# EAGLE design H3AR1 (EAGLE 9.6.1)
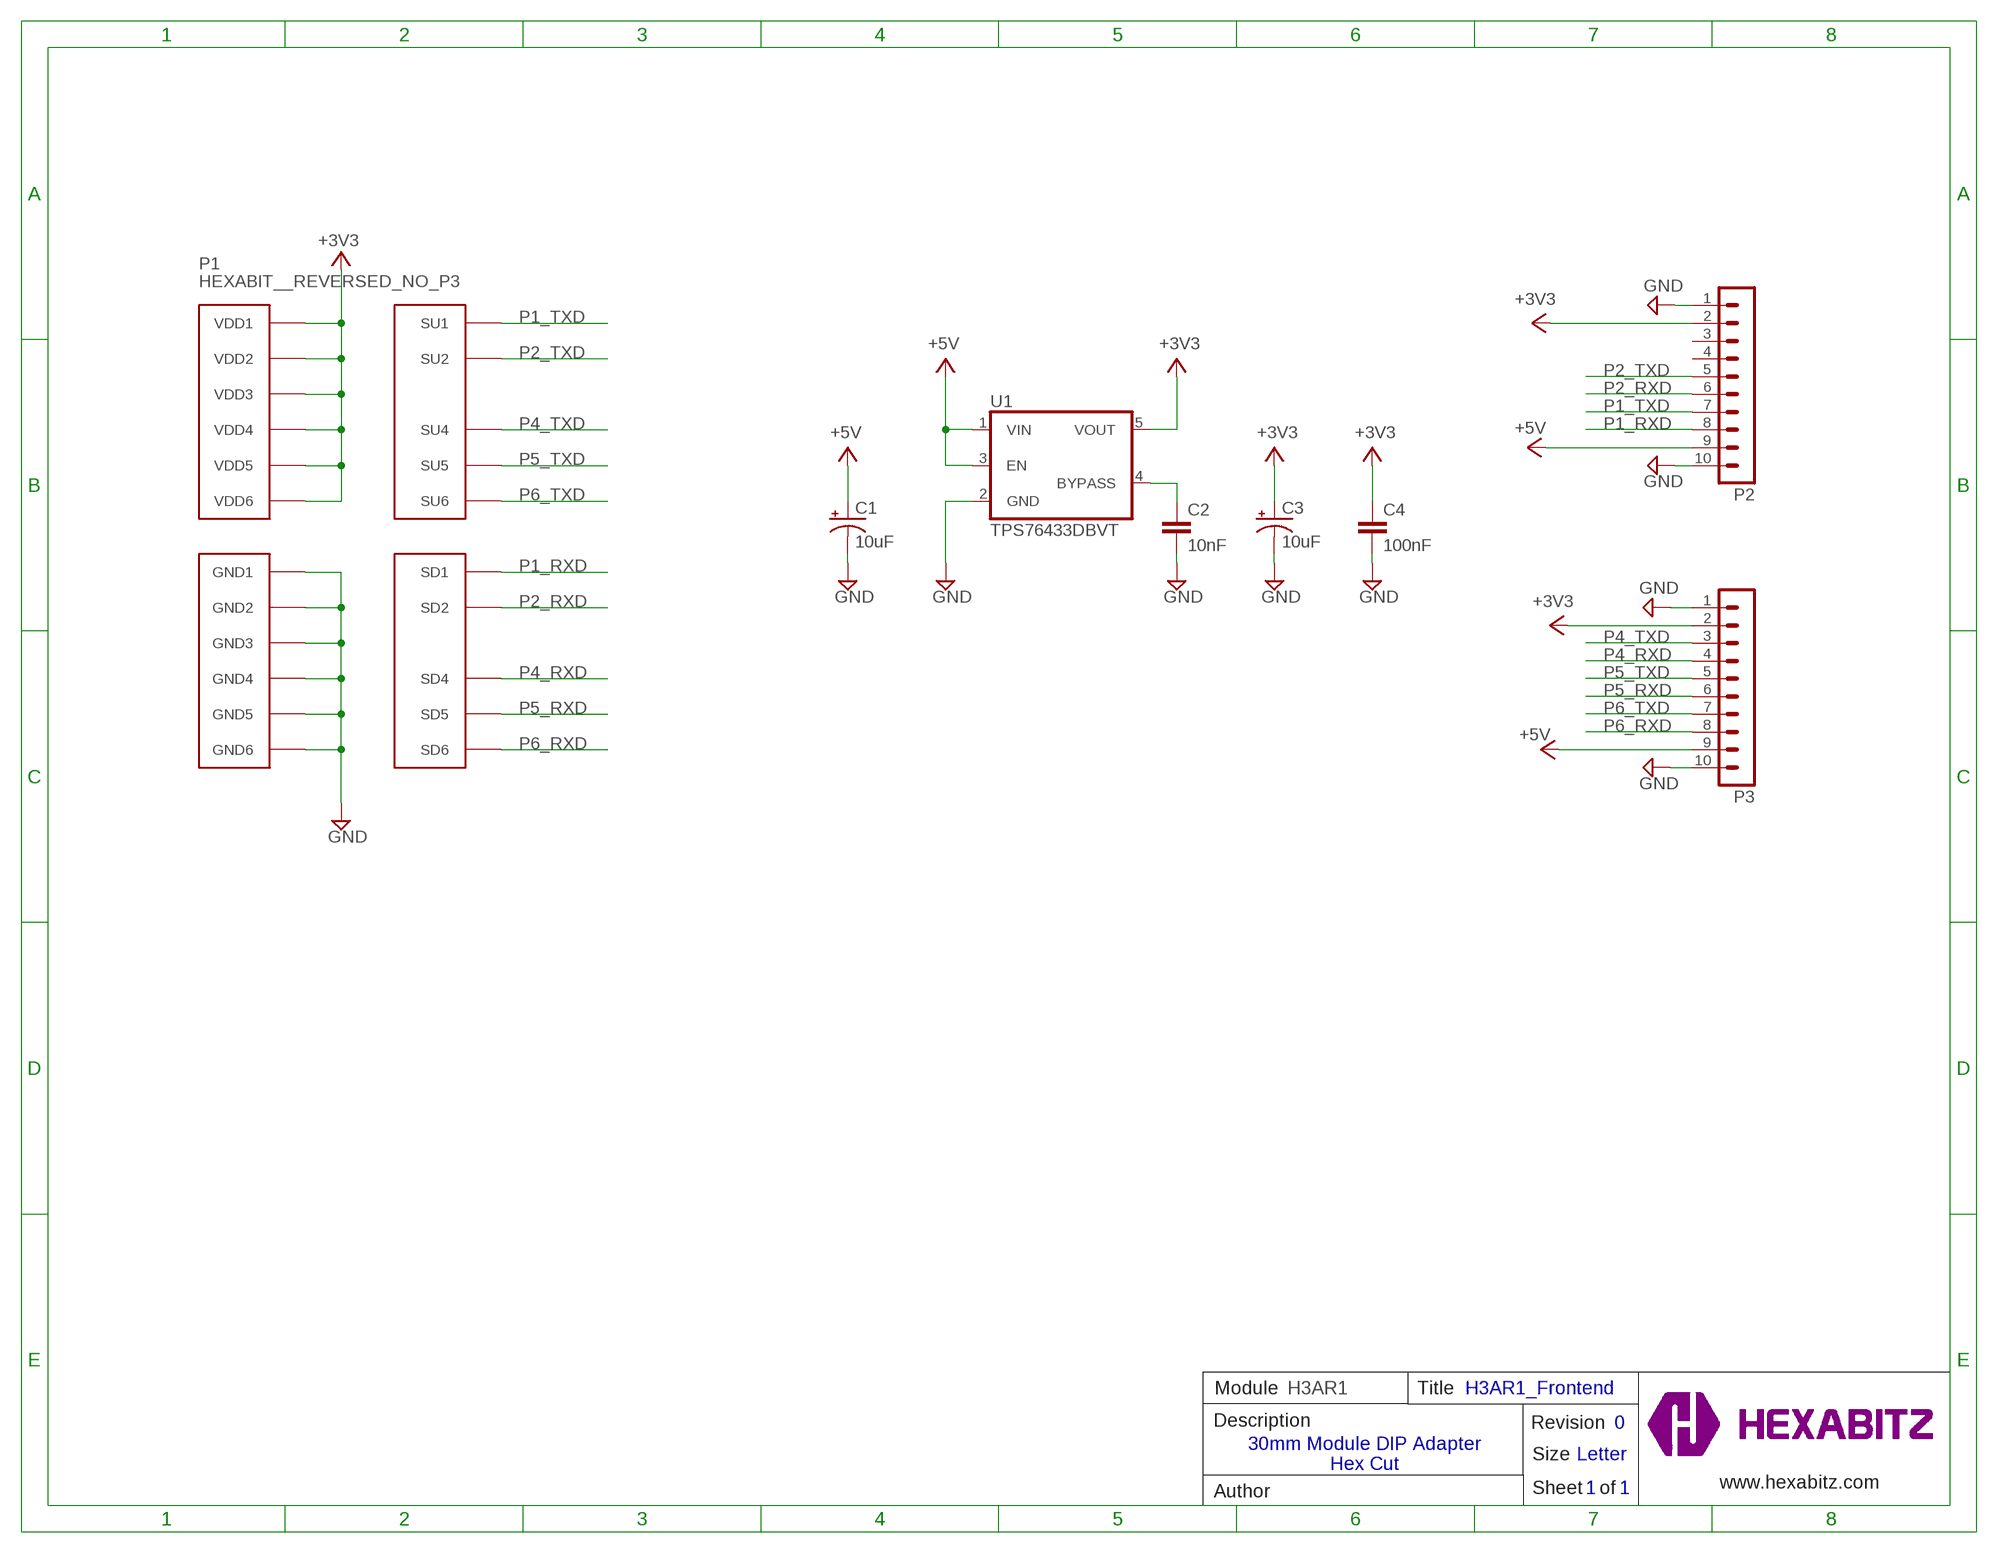
[diagram p0: schematic, sheet 1]

## Parts
C1  10uF  C-1210-POL  [C-1210-POL]
C2  10nF  C-0603  [C-0603]
C3  10uF  C-1210-POL  [C-1210-POL]
C4  100nF  C-0603  [C-0603]
P1  HEXABIT__REVERSED_NO_P3  [HEXABIT_17.60_REVERSED_NO_P3]
P2  MA10-1  [MA10-1]
P3  MA10-1  [MA10-1]
TRIMBLE-LOGO1  HEXA-LOGO  [HEXA-LOGO]
U1  TPS76433DBVT  [SOT25]

## Nets
+3V3: C3.1(+) C4.1 P1.PAD_PU7(VDD1) P1.PAD_PU8(VDD2) P1.PAD_PU9(VDD3) P1.PAD_PU10(VDD4) P1.PAD_PU11(VDD5) P1.PAD_PU12(VDD6) P2.2 P3.2 U1.5(VOUT)
+5V: C1.1(+) P2.9 P3.9 U1.1(VIN) U1.3(EN)
GND: C1.2(-) C2.2 C3.2(-) C4.2 P1.PAD_PD7(GND1) P1.PAD_PD8(GND2) P1.PAD_PD9(GND3) P1.PAD_PD10(GND4) P1.PAD_PD11(GND5) P1.PAD_PD12(GND6) P2.1 P2.10 P3.1 P3.10 U1.2(GND)
N$1: C2.1 U1.4(BYPASS)
P1_RXD: P1.PAD_PD1(SD1) P2.8
P1_TXD: P1.PAD_PU1(SU1) P2.7
P2_RXD: P1.PAD_PD2(SD2) P2.6
P2_TXD: P1.PAD_PU2(SU2) P2.5
P4_RXD: P1.PAD_PD4(SD4) P3.4
P4_TXD: P1.PAD_PU4(SU4) P3.3
P5_RXD: P1.PAD_PD5(SD5) P3.6
P5_TXD: P1.PAD_PU5(SU5) P3.5
P6_RXD: P1.PAD_PD6(SD6) P3.8
P6_TXD: P1.PAD_PU6(SU6) P3.7
Unconnected: P2.3 P2.4

## Notes on the sheet
- Module | H3AR1 | Title | H3AR1_Frontend
- Description | Revision | 0
- 30mm Module DIP Adapter
  Hex Cut
- Size | Letter
- www.hexabitz.com
- Author | Sheet   of | 1 | 1
- C:/Users/Admin/Desktop/logodraft.bmp

## Library data of the parts
C1 C3 = Hexabitz:C-1210-POL: Cap Tant Solid SMD 1210 Pol; CAPACITANCE: 10uF; MFN: AVX; MPN: TPSB106K016R0500; OCTOPART_URL: https://octopart.com/tpsb106k016r0500-avx-1436890?r=sp#
C2 = Hexabitz:C-0603: CAP CER 10% X7R 0603; CAPACITANCE: 10nF; MFN: KEMET; MPN: C0603C103K5RACTU; OCTOPART_URL: https://octopart.com/c0603c103k5ractu-kemet-133094?r=sp&s=R_iPBxLnSmGqhkU2rIMFpg; TOLERANCE: 10%; VOLTAGE_RATING: 50V
C4 = Hexabitz:C-0603: CAP CER 10% X7R 0603; CAPACITANCE: 100nF; MFN: KEMET; MPN: C0603C104K8RACTU; OCTOPART_URL: https://octopart.com/c0603c104k8ractu-kemet-145075?r=sp&s=9bS9ASSwSEqMCE9KBEQZ0g; TOLERANCE: 10%; VOLTAGE_RATING: 10V
P1 = hexabitz_connectors:HEXABIT_?_REVERSED_NO_P3: Hexabitz Hexagon Module Connector Hexagon side length = 18.00mm. Reversed inside-out.
P2 P3 = Hexabitz:MA10-1: PIN HEADER; MFN: Würth Elektronik; MPN: 61301011121; OCTOPART_URL: https://octopart.com/61301011121-w%C3%BCrth+elektronik-18818159?r=sp; OC_FARNELL: unknown; OC_NEWARK: unknown
TRIMBLE-LOGO1 = HEXABITZ_USER_INTERFACE_PARTS:HEXA-LOGO: Trimble-Logo
U1 = Hexabitz:TPS764: 150mA Low Noise LDO Voltage Regulator with Enable; MFN: Texas Instruments; MPN: TPS76433DBVT; OCTOPART_URL: https://octopart.com/tps76433dbvt-texas+instruments-69873?r=sp&s=0aHKKhMLSUCTmmqJkhwwIQ

## Board
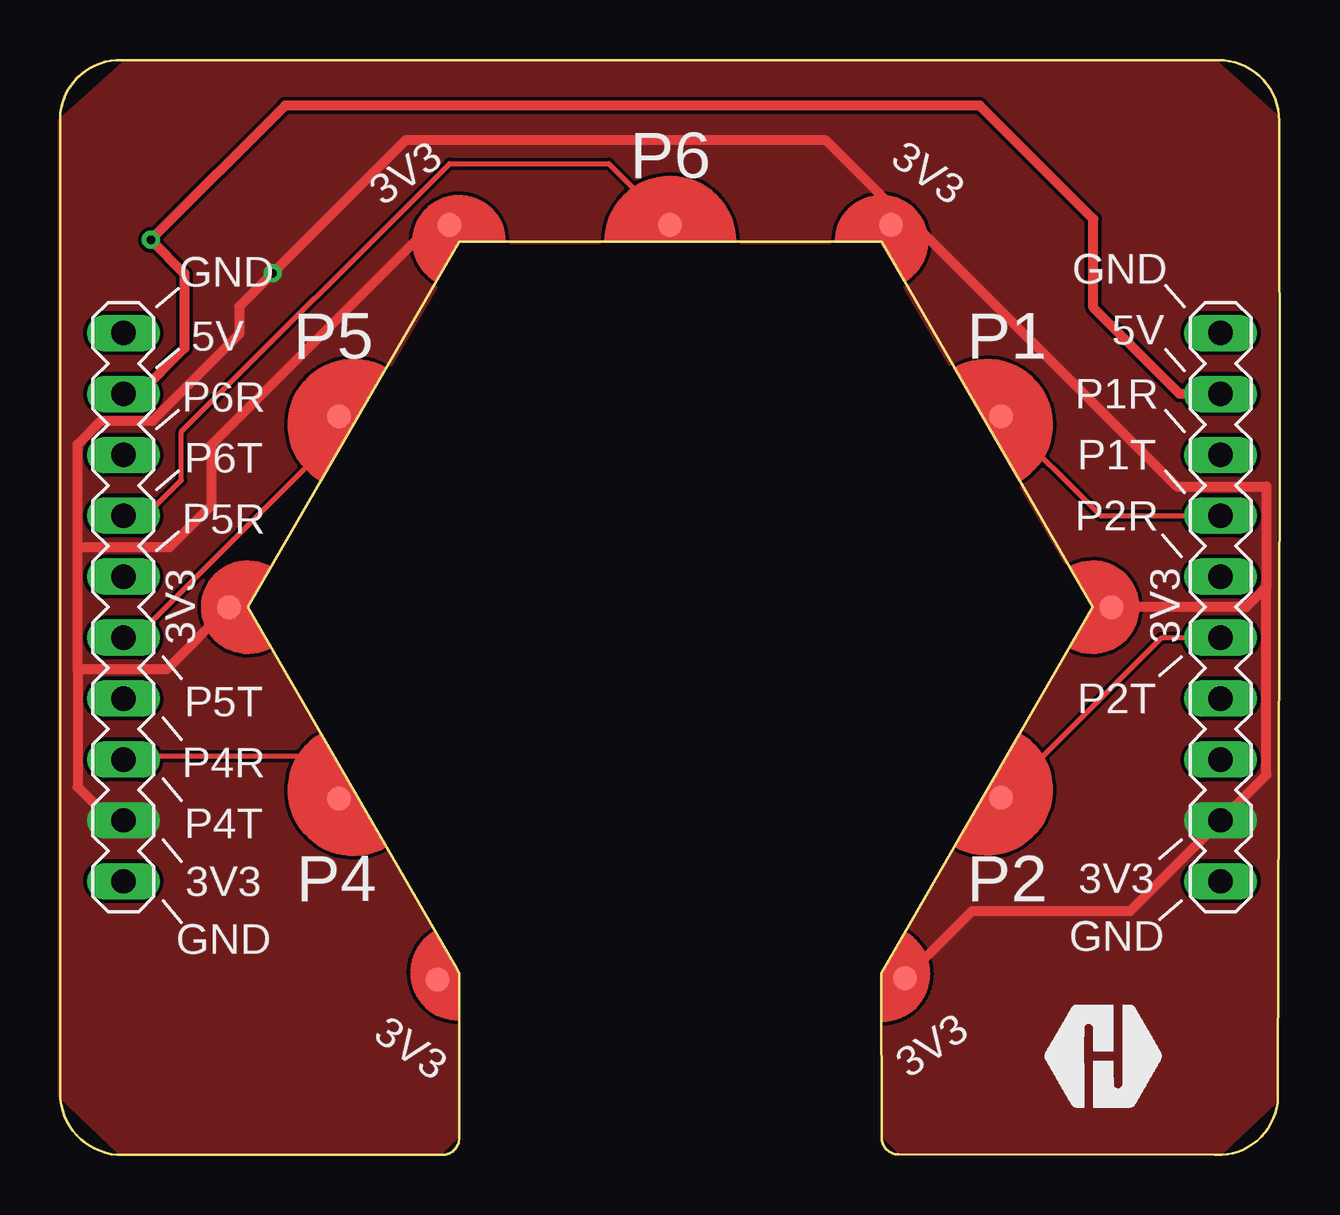
[diagram p1: board, top side]
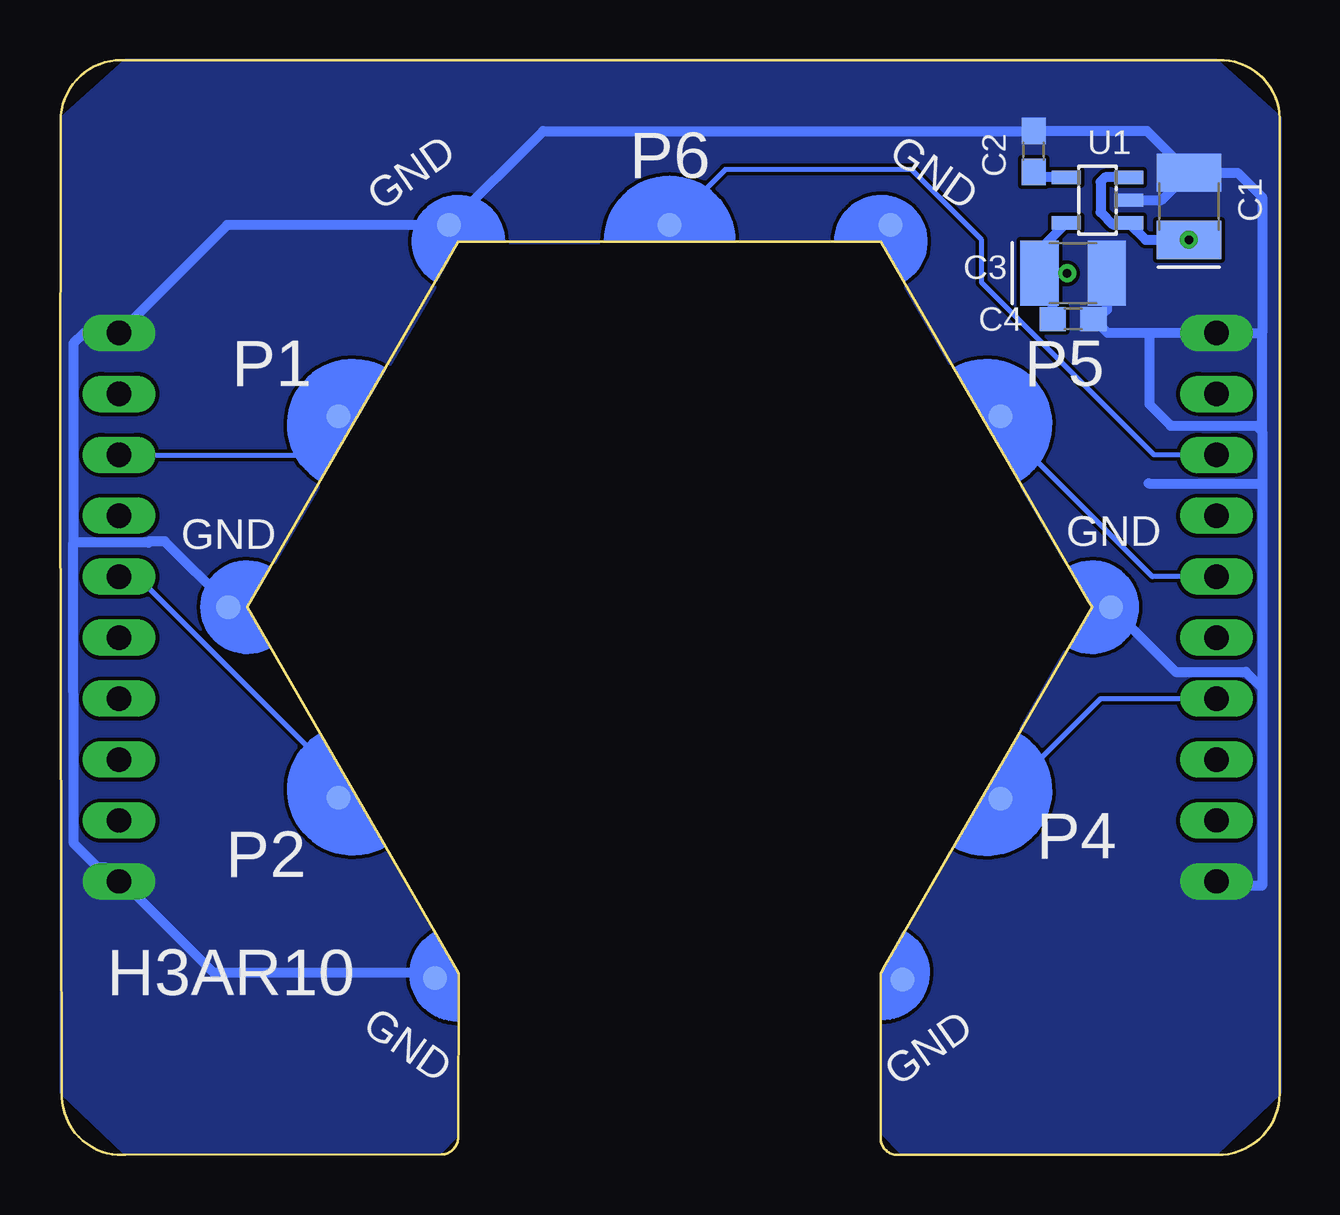
[diagram p2: board, bottom side, seen from below]

Size 50.83 x 45.64 mm. Coordinates in mm from the lower left corner, seen from the top.
Copper layers (1*16): Top 0.035mm / dielectric 1.5mm / Bottom 0.035mm
Design rules "2_layer *": minimum track width 6mil, minimum drill 0.25mm, track to track 6mil, track to pad 6mil, pad to pad 6mil, via to via 6mil, smd to smd 0mil, copper to edge 0mil, drill to drill 8mil, minimum pad ring 10mil, minimum via ring 6mil, stop-mask expansion 2mil, vias tented up to drill 15mil, thermal gap 10mil

### Footprints (pad centres in the part's own frame; a part is rotated, then mirrored left to right if it is on the bottom)
C-1210-POL = smd 1.6 x 2.7: 1 -1.4,0; 2 1.4,0
C-0603 = smd 1.1 x 1: 1 -0.85,0; 2 0.85,0
HEXABIT_17.60_REVERSED_NO_P3 = smd 1 x 1 bottom: PAD_PD1 13.792,7.95; PAD_PD2 13.792,-7.95; PAD_PD4 -13.792,-7.976; PAD_PD5 -13.792,7.95; PAD_PD6 0,15.926; PAD_PD7 9.195,15.926; PAD_PD8 18.39,0; PAD_PD9 9.779,-15.469; PAD_PD10 -9.703,-15.519; PAD_PD11 -18.39,0; PAD_PD12 -9.195,15.926 | smd 1 x 1: PAD_PU1 13.792,7.95; PAD_PU2 13.792,-7.95; PAD_PU4 -13.792,-7.976; PAD_PU5 -13.792,7.95; PAD_PU6 0,15.926; PAD_PU7 9.195,15.926; PAD_PU8 18.39,0; PAD_PU9 9.779,-15.469; PAD_PU10 -9.703,-15.519; PAD_PU11 -18.39,0; PAD_PU12 -9.195,15.926
MA10-1 = drill 1.016 long: 1 -11.43,0; 2 -8.89,0; 3 -6.35,0; 4 -3.81,0; 5 -1.27,0; 6 1.27,0; 7 3.81,0; 8 6.35,0; 9 8.89,0; 10 11.43,0
SOT25 = smd 0.55 x 1.2: 1 -0.95,-1.3; 2 0,-1.3; 3 0.95,-1.3; 4 0.95,1.3; 5 -0.95,1.3

### Placement (x,y rotation side)
C1  3.78,39.54 90 bottom
C2  10.26,41.83 90 bottom
C3  8.61,36.75 0 bottom
C4  8.61,34.85 0 bottom
P1  25.43,22.83 0 top
P2  48.36,22.83 90 top
P3  2.64,22.83 90 top
TRIMBLE-LOGO1  43.54,1.96 0 top
U1  7.59,39.8 90 bottom

### Tracks (layer width: path | path; a pad name or v marks a point on that pad's centre or on a via)
+3V3  (via drill 0.35 pad 0.75)
  Top 0.406: P1.PAD_PU11 4.44,20.24 0.74,20.24 | 0.74,20.24 0.74,15.34 2.13,13.94 | 0.74,20.24 0.74,25.32 | 0.74,25.32 0.74,29.62 1.72,30.61 3.87,30.61 7.47,34.21 7.47,35.36 v8.86,36.75 14.4,42.29 31.9,42.29 34.96,39.23 34.96,39.1 P1.PAD_PU7 34.75,38.89 35.51,38.89 46.53,27.86 50.27,27.86 50.27,23.67 | 0.74,25.32 4.55,25.32 6.3,27.07 6.3,29.59 15.47,38.76 P1.PAD_PU12 | P1.PAD_PU9 38,10.16 44.58,10.16 P2.2 50.27,15.85 50.27,23.67 | 50.27,23.67 49.43,22.83 P1.PAD_PU8
  Bottom 0.406: U1.5 10.01,37.74 C3.1 | C4.1 9.46,36.2 C3.1 | v8.86,36.75 C3.1
  pour Top (no thermals): 30.71,45.52 30.71,38.02 16.74,38.02 7.85,22.78 16.61,7.42 16.61,0.81 15.85,0.05 2.51,0.05 -0.03,2.46 -0.03,43.1 2.64,45.52
  pour Top (no thermals): 20.17,45.52 20.17,38.02 34.14,38.02 43.03,22.78 34.26,7.42 34.26,0.81 35.03,0.05 48.37,0.05 50.65,2.22 50.65,43.33 48.23,45.52
+5V  (via drill 0.35 pad 0.75)
  Top 0.406: P3.9 3.28,31.72 5.18,33.63 5.18,36.75 C1.1 9.38,43.74 38.33,43.74 43.05,39.01 43.05,35.33 46.65,31.72 P2.9
  Bottom 0.406: C1.1 5.59,38.14 U1.1 6.36,38.79 6.96,38.79 7.47,39.29 7.47,40.56 7.28,40.75 U1.3
  other vias: 3.78,38.14
GND
  Bottom 0.406: P1.PAD_PD11 4.34,20.14 1.42,20.14 0.74,19.46 | 0.74,19.46 0.74,11.23 2.46,11.23 P3.1 | 5.44,34.26 P3.10 0.74,34.26 | 5.44,34.26 7.18,34.26 7.68,34.77 | 7.68,34.77 C4.2 | 5.44,34.26 5.44,31.29 4.55,30.4 0.99,30.4 0.74,30.15 | 0.74,30.15 0.74,27.99 | 0.74,27.99 0.74,19.46 | U1.2 4.93,39.8 C1.2 | C3.2 7.21,35.23 7.68,34.77 | 5.46,27.99 0.74,27.99 | P1.PAD_PD9 35.46,7.62 44.45,7.62 48.23,11.4 P2.1 48.95,11.99 49.25,11.99 50.25,12.98 50.27,25.53 | P1.PAD_PD8 43.81,22.94 46.46,25.58 47.09,25.58 47.14,25.53 50.27,25.53 | 50.27,25.53 50.27,33.83 49.83,34.26 P2.10 43.87,38.76 P1.PAD_PD7 30.7,42.68 C2.2 5.52,42.68 C1.2 | C1.2 1.75,40.94 0.74,39.93 0.74,34.26 | 0.74,30.15 0.74,34.26
  pour Bottom (no thermals): 30.71,45.64 30.71,38.15 16.74,38.15 7.85,22.91 16.61,7.54 16.61,0.94 15.72,0.05 2.64,0.05 -0.03,2.59 -0.03,43.23 2.64,45.64
  pour Bottom (no thermals): 20.17,45.64 20.17,38.02 34.14,38.02 43.03,22.78 34.26,7.42 34.26,0.81 35.03,0.05 48.11,0.05 50.77,2.58 50.77,43.22 48.09,45.64
N$1
  Bottom 0.406: U1.4 10.03,40.75 C2.1
P1_RXD
  Bottom 0.203: P2.8 40.82,29.18 P1.PAD_PD1
P1_TXD
  Top 0.203: P1.PAD_PU1 43.36,26.64 P2.7
P2_RXD
  Bottom 0.203: P2.6 47.6,24.1 39.22,15.72 P1.PAD_PD2
P2_TXD
  Top 0.203: P1.PAD_PU2 45.9,21.56 P2.5
P4_RXD
  Bottom 0.203: P1.PAD_PD4 7.47,19.02 P3.4
P4_TXD
  Top 0.203: P1.PAD_PU4 9.88,16.61 2.77,16.61 P3.3
P5_RXD
  Bottom 0.203: P1.PAD_PD5 11.63,30.43 5.31,24.1 P3.6
P5_TXD
  Top 0.203: P3.5 3.15,21.56 11.63,30.05 P1.PAD_PU5
P6_RXD
  Bottom 0.203: P3.8 5.23,29.18 12.42,36.37 12.42,38.15 15.34,41.07 23.11,41.07 P1.PAD_PD6
P6_TXD
  Top 0.203: P3.7 3.57,26.64 5.05,28.13 5.05,30.15 16.23,41.33 22.86,41.33 P1.PAD_PU6

### Text on the board
tPlace: P6 | 3V3 | 3V3 | GND | GND | 5V | P5 | P1 | 5V | P6R | P1R | P6T | P1T | P5R | P2R | 3V3 | 3V3 | P5T | P2T | P4R | P4T | P4 | P2 | 3V3 | 3V3 | GND | GND | 3V3 | 3V3
bPlace: P6 | GND | GND | P5 | P1 | GND | GND | P4 | P2 | H3AR10 | GND | GND